# EAGLE design SparkFun_ZED-F9R_v11 (EAGLE 9.6.2)
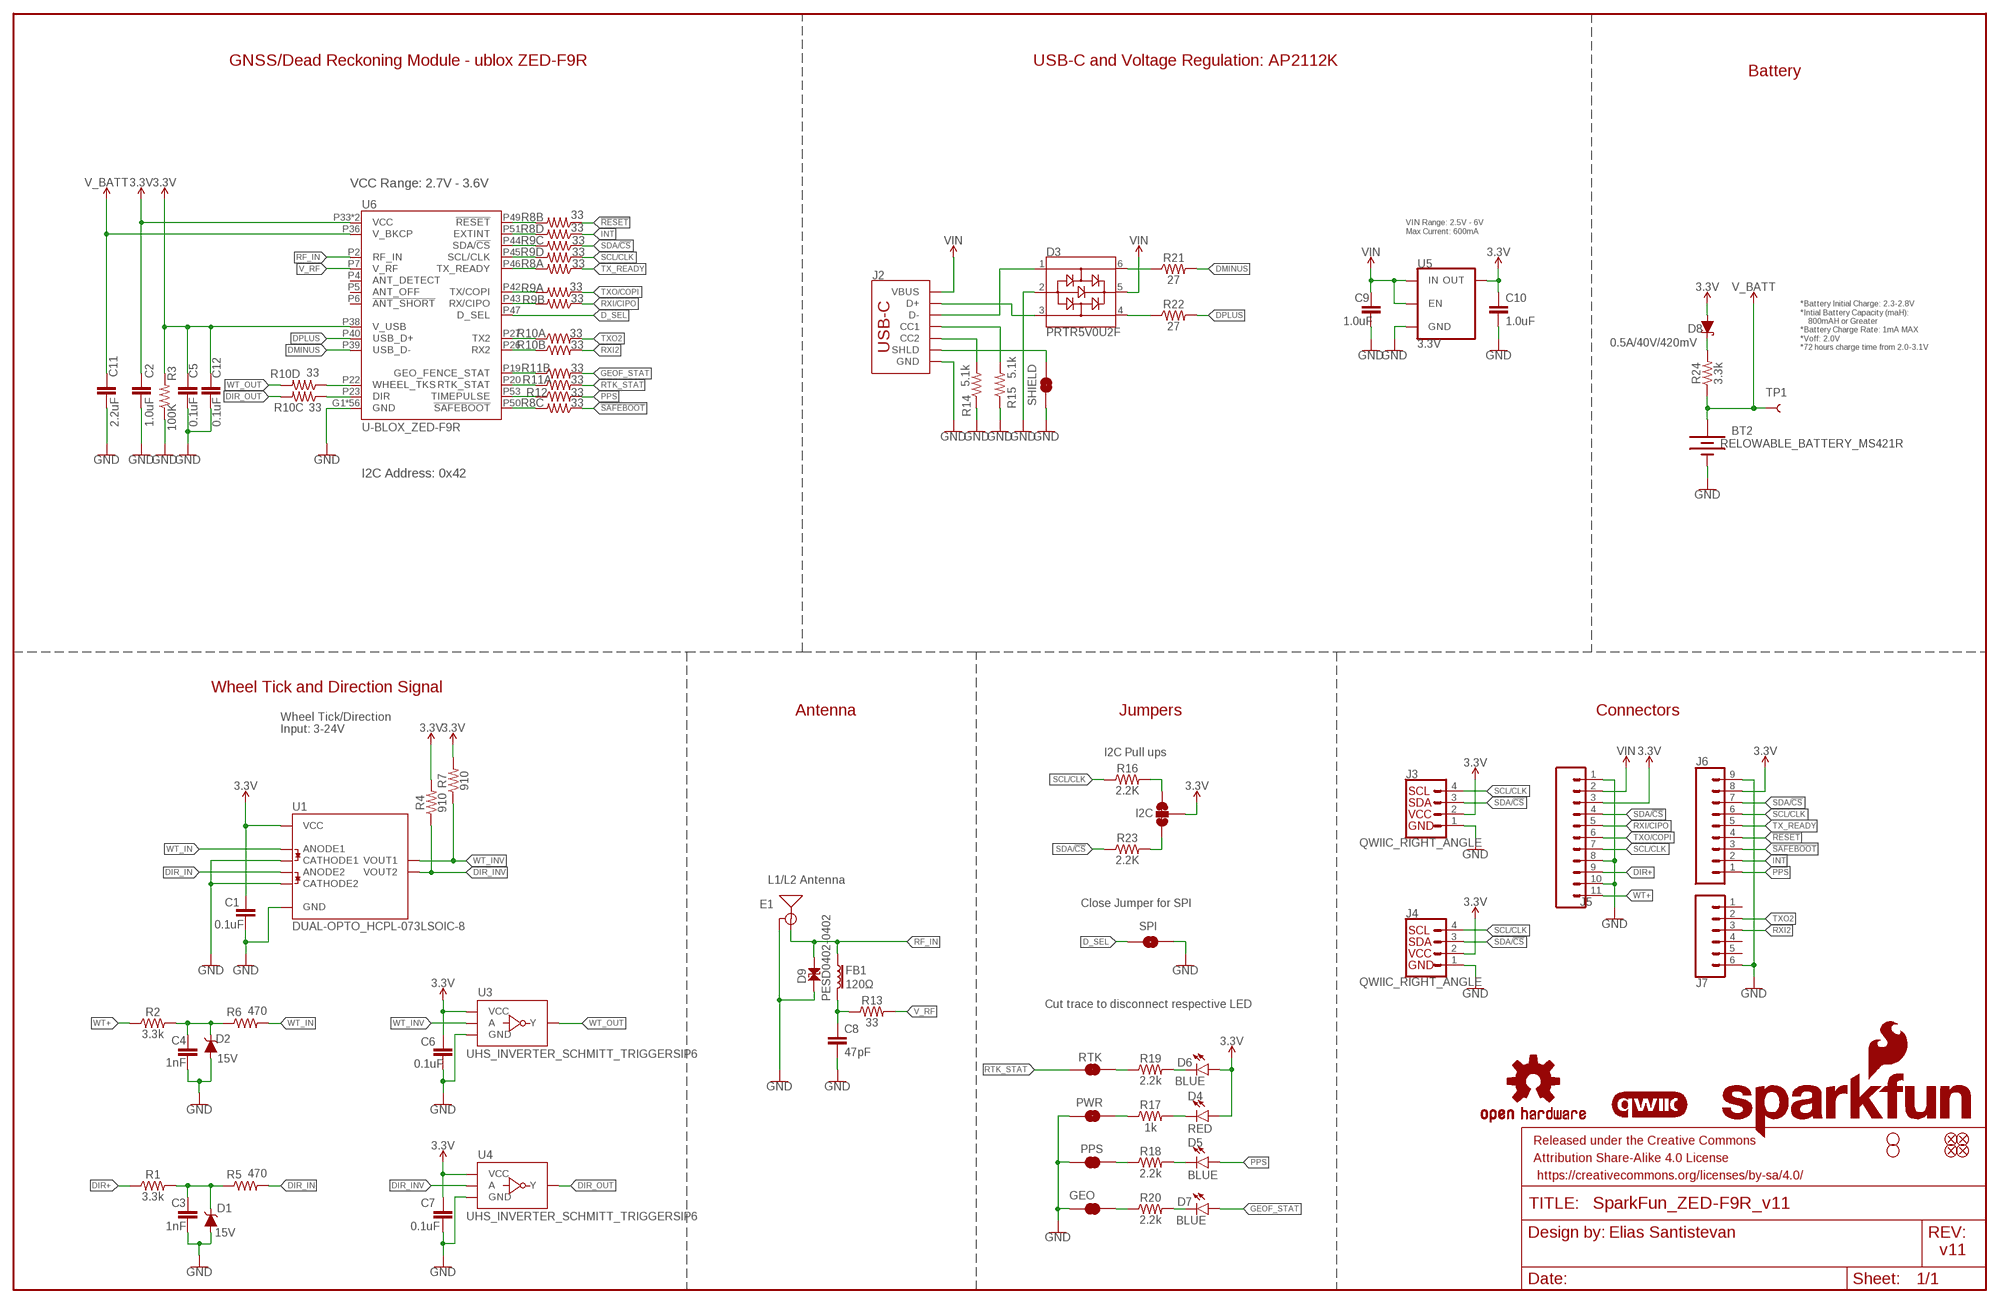
[diagram p0: schematic, sheet 1]

## Parts
$1_25_$_2020-03-30_22-52-05  STAND-OFFTIGHT  [STAND-OFF-TIGHT]
BT2  RELOWABLE_BATTERY_MS421R  [MS421R_IV03E]
C1  0.1uF  0.1UF-0402T-6.3V-10%-X7R  [0402-TIGHT]
C2  1.0uF  1.0UF-0402T-16V-10%  [0402-TIGHT]
C3  1nF  1.0NF/1000PF-0402-25V-10%-X7R  [0402]
C4  1nF  1.0NF/1000PF-0402-25V-10%-X7R  [0402]
C5  0.1uF  0.1UF-0402T-6.3V-10%-X7R  [0402-TIGHT]
C6  0.1uF  0.1UF-0402T-6.3V-10%-X7R  [0402-TIGHT]
C7  0.1uF  0.1UF-0402T-6.3V-10%-X7R  [0402-TIGHT]
C8  47pF  47PF-0402-25V-5%-X7R  [0402]
C9  1.0uF  1.0UF-0402T-16V-10%  [0402-TIGHT]
C10  1.0uF  1.0UF-0402T-16V-10%  [0402-TIGHT]
C11  2.2uF  2.2UF-0402_TIGHT-10V-10%-X5R  [0402-TIGHT]
C12  0.1uF  0.1UF-0402T-6.3V-10%-X7R  [0402-TIGHT]
D1  15V  DIODE-ZENER-BZX84C15LT3G  [SOT23-3]
D2  15V  DIODE-ZENER-BZX84C15LT3G  [SOT23-3]
D3  PRTR5V0U2F  [SOT886]
D4  RED  LED-RED0603  [LED-0603]
D5  BLUE  LED-BLUE0603  [LED-0603]
D6  BLUE  LED-BLUE0603  [LED-0603]
D7  BLUE  LED-BLUE0603  [LED-0603]
D8  0.5A/40V/420mV  DIODE-SCHOTTKY-PMEG4005EJ  [SOD-323]
D9  PESD0402-0402  [0402]
E1  ANTENNA-SMA-GROUNDEDEDGE_SMA  [SMA-EDGE]
FB1  120Ω  FERRITE_BEAD-120_OHM-0402  [0402]
FD1  FIDUCIALUFIDUCIAL  [FIDUCIAL-MICRO]
FD2  FIDUCIALUFIDUCIAL  [FIDUCIAL-MICRO]
FD3  FIDUCIALUFIDUCIAL  [FIDUCIAL-MICRO]
FD4  FIDUCIALUFIDUCIAL  [FIDUCIAL-MICRO]
FRAME1  FRAME-LEDGER  [CREATIVE_COMMONS]
GEO  JUMPER-SMT_2_NC_TRACE_SILK  [SMT-JUMPER_2_NC_TRACE_SILK]
H2  STAND-OFFTIGHT  [STAND-OFF-TIGHT]
I2C  JUMPER-SMT_3_2-NC_TRACE_SILK  [SMT-JUMPER_3_2-NC_TRACE_SILK]
J2  USB_C_2-LAYER_PADS  [USB-C-16P-2LAYER-PADS]
J3  QWIIC_RIGHT_ANGLE  QWIIC_CONNECTORJS-1MM  [JST04_1MM_RA]
J4  QWIIC_RIGHT_ANGLE  QWIIC_CONNECTORJS-1MM  [JST04_1MM_RA]
J5  CONN_111X11_NO_SILK  [1X11_NO_SILK]
J6  CONN_09NO_SILK  [1X09_NO_SILK]
J7  CONN_06NO_SILK_NO_POP  [1X06_NO_SILK]
LOGO1  OSHW-LOGOS  [OSHW-LOGO-S]
LOGO2  QWIIC_LOGO_4MM  [QWIIC_4MM]
LOGO3  SFE_LOGO_NAME_FLAME.2_INCH  [SFE_LOGO_NAME_FLAME_.2]
PPS  JUMPER-SMT_2_NC_TRACE_SILK  [SMT-JUMPER_2_NC_TRACE_SILK]
PWR  JUMPER-SMT_2_NC_TRACE_SILK  [SMT-JUMPER_2_NC_TRACE_SILK]
R1  3.3k  3.3KOHM-0603-1/10W-1%  [0603]
R2  3.3k  3.3KOHM-0603-1/10W-1%  [0603]
R3  100K  100KOHM-0402-1/16W-1%  [0402]
R4  910  910OHM-0603-1/10W-5%  [0603]
R5  470  470OHM-0603-1/10W-1%  [0603]
R6  470  470OHM-0603-1/10W-1%  [0603]
R7  910  910OHM-0603-1/10W-5%  [0603]
R8  33  33OHM_RA-1206-1/16W-5%  [1206_RA]
R9  33  33OHM_RA-1206-1/16W-5%  [1206_RA]
R10  33  33OHM_RA-1206-1/16W-5%  [1206_RA]
R11  33  33OHM_RA-1206-1/16W-5%  [1206_RA]
R12  33  33OHM-0603-1/10W-1%  [0603]
R13  33  33OHM-0603-1/10W-1%  [0603]
R14  5.1k  5.1KOHM-0402-1/16W-1%  [0402]
R15  5.1k  5.1KOHM-0402-1/16W-1%  [0402]
R16  2.2K  2.2KOHM-0402-1/16W-1%  [0402]
R17  1KOHM-0402-1/16W-1%  [0402]
R18  2.2k  2.2KOHM-0603-1/10W-1%  [0603]
R19  2.2k  2.2KOHM-0603-1/10W-1%  [0603]
R20  2.2k  2.2KOHM-0603-1/10W-1%  [0603]
R21  27  27OHM-0603-1/10W-1%  [0603]
R22  27  27OHM-0603-1/10W-1%  [0603]
R23  2.2K  2.2KOHM-0402-1/16W-1%  [0402]
R24  3.3k  3.3KOHM-0603-1/10W-1%  [0603]
RTK  JUMPER-SMT_2_NC_TRACE_SILK  [SMT-JUMPER_2_NC_TRACE_SILK]
SHIELD  JUMPER-SMT_2_NC_TRACE_SILK  [SMT-JUMPER_2_NC_TRACE_SILK]
SPI  JUMPER-SMT_2_NO_SILK  [SMT-JUMPER_2_NO_SILK]
TP1  TEST-POINT3X5  [PAD.03X.05]
U1  DUAL-OPTO_HCPL-073LSOIC-8  [SO08]
U3  UHS_INVERTER_SCHMITT_TRIGGERSIP6  UHS_INVERTER_SCHMITT_TRIGGER_MPAK2  [SIP6_MICROPAK2]
U4  UHS_INVERTER_SCHMITT_TRIGGERSIP6  UHS_INVERTER_SCHMITT_TRIGGER_MPAK2  [SIP6_MICROPAK2]
U5  3.3V  V_REG_AP2112K-3.3V  [SOT23-5]
U6  U-BLOX_ZED-F9R  [UBLOX_ZED_F9R]

## Nets
3.3V: C1.1 C2.1 C5.1 C6.1 C7.1 C10.1 C12.1 D4.A D6.A D8.A I2C.2 J3.2 J4.2 J5.3 J6.8 R3.2 R4.2 R7.2 U1.8(VCC) U3.P6(VCC) U4.P6(VCC) U5.5(OUT) U6.P33(VCC) U6.P34(VCC) U6.P38(V_USB)
!RESET: J6.4 R8.P2
!SAFEBOOT: J6.3 R8.P3
D_SEL: SPI.1 U6.P47(D_SEL)
DIR+: J5.9 R1.1
DIR_IN: R5.2 U1.4(ANODE2)
DIR_INV: R4.1 U1.6(VOUT2) U4.P2(A)
DIR_OUT: R10.P6 U4.P4(Y)
DMINUS: R21.2 U6.P39(USB_D-)
DPLUS: R22.2 U6.P40(USB_D+)
GEOF_STAT: D7.A R11.P7
GND: BT2.- C1.2 C2.2 C3.2 C4.2 C5.2 C6.2 C7.2 C8.2 C9.2 C10.2 C11.2 C12.2 D1.1(A) D2.1(A) D3.2 D9.1 E1.GND@0(GND) E1.GND@1(GND) E1.GND@2(GND) E1.GND@3(GND) GEO.1 J2.GND J2.GND2(GND) J3.1 J4.1 J5.1 J5.8 J5.10 J6.9 J7.6 PPS.1 PWR.1 R3.1 R14.1 R15.1 SHIELD.1 SPI.2 U1.2(CATHODE1) U1.3(CATHODE2) U1.5(GND) U3.P3(GND) U4.P3(GND) U5.2(GND) U6.G1(GND) U6.G2(GND) U6.G3(GND) U6.G4(GND) U6.G5(GND) U6.G6(GND) U6.G7(GND) U6.G8(GND) U6.G9(GND) U6.G10(GND) U6.G11(GND) U6.G12(GND) U6.G13(GND) U6.G14(GND) U6.G15(GND) U6.G16(GND) U6.G17(GND) U6.G18(GND) U6.G19(GND) U6.G20(GND) U6.G21(GND) U6.G22(GND) U6.G23(GND) U6.G24(GND) U6.G25(GND) U6.G26(GND) U6.G27(GND) U6.G28(GND) U6.G29(GND) U6.G30(GND) U6.G31(GND) U6.G32(GND) U6.G33(GND) U6.G34(GND) U6.G35(GND) U6.G36(GND) U6.G37(GND) U6.G38(GND) U6.G39(GND) U6.G40(GND) U6.G41(GND) U6.G42(GND) U6.G43(GND) U6.G44(GND) U6.G45(GND) U6.G46(GND) U6.G47(GND) U6.G48(GND) U6.P1(GND) U6.P3(GND) U6.P12(GND) U6.P14(GND) U6.P32(GND) U6.P37(GND) U6.P41(GND) U6.P48(GND)
INT: J6.2 R8.P4
N$1: I2C.1 R23.2
N$2: D8.C R24.2
N$3: I2C.3 R16.2
N$4: D4.C R17.2
N$5: C8.1 FB1.2 R13.1
N$6: D3.3 J2.A6(D+) J2.B6(D+)
N$7: D3.1 J2.A7(D-) J2.B7(D-)
N$8: PWR.2 R17.1
N$9: D3.6 R21.1
N$10: D3.4 R22.1
N$11: R8.P7 U6.P49(!RESET!)
N$12: R8.P5 U6.P51(EXTINT)
N$14: J2.B5(CC2) R14.2
N$15: J2.A5(CC1) R15.2
N$16: R9.P6 U6.P44(SDA/!CS!)
N$17: R9.P5 U6.P45(SCL/CLK)
N$18: R8.P8 U6.P46(TX_READY)
N$19: R9.P8 U6.P42(TX/COPI)
N$20: R9.P7 U6.P43(RX/CIPO)
N$21: R10.P1 U6.P27(TX2)
N$22: R19.1 RTK.2
N$23: PPS.2 R18.1
N$24: D5.C R18.2
N$25: D6.C R19.2
N$26: R10.P2 U6.P26(RX2)
N$27: R11.P2 U6.P19(GEO_FENCE_STAT)
N$28: R11.P1 U6.P20(RTK_STAT)
N$29: R12.1 U6.P53(TIMEPULSE)
N$30: R8.P6 U6.P50(!SAFEBOOT!)
N$31: R10.P4 U6.P22(WHEEL_TKS)
N$32: R10.P3 U6.P23(DIR)
N$33: GEO.2 R20.1
N$34: D7.C R20.2
N$35: C4.1 D2.3(C) R2.2 R6.1
N$37: C3.1 D1.3(C) R1.2 R5.1
PPS: D5.A J6.1 R12.2
RF_IN [Antenna]: D9.2 E1.SIG(SIGNAL) FB1.1 U6.P2(RF_IN)
RTK_STAT: R11.P8 RTK.1
RXI2: J7.3 R10.P7
RXI/CIPO: J5.5 R9.P2
SCL/CLK: J3.4 J4.4 J5.7 J6.6 R9.P4 R16.1
SDA/!CS: J3.3 J4.3 J5.4 J6.7 R9.P3 R23.1
SHIELD: J2.SHLD1(SHLD) J2.SHLD2(SHLD) J2.SHLD3(SHLD) J2.SHLD4(SHLD) SHIELD.2
TX_READY: J6.5 R8.P1
TXO2: J7.2 R10.P8
TXO/COPI: J5.6 R9.P1
V_BATT: BT2.+ C11.1 R24.1 TP1.1 U6.P36(V_BKCP)
V_RF: R13.2 U6.P7(V_RF)
VIN: C9.1 D3.5 J2.VBUS1(VBUS) J2.VBUS2(VBUS) J5.2 U5.1(IN) U5.3(EN)
WT+: J5.11 R2.1
WT_IN: R6.2 U1.1(ANODE1)
WT_INV: R7.1 U1.7(VOUT1) U3.P2(A)
WT_OUT: R10.P5 U3.P4(Y)
Unconnected: J7.1 J7.4 J7.5 R11.P3 R11.P4 R11.P5 R11.P6 U6.P4(ANT_DETECT) U6.P5(ANT_OFF) U6.P6(!ANT_SHORT!)

## Notes on the sheet
- GNSS/Dead Reckoning Module - ublox ZED-F9R | USB-C and Voltage Regulation: AP2112K
- Battery
- VCC Range: 2.7V - 3.6V
- VIN Range: 2.5V - 6V
  Max Current: 600mA
- *Battery Initial Charge: 2.3-2.8V
  *Intial Battery Capacity (maH): 
      800mAH or Greater
  *Battery Charge Rate: 1mA MAX
  *Voff: 2.0V
  *72 hours charge time from 2.0-3.1V
- I2C Address: 0x42
- Wheel Tick and Direction Signal
- Antenna | Jumpers | Connectors
- Wheel Tick/Direction
  Input: 3-24V
- I2C Pull ups
- L1/L2 Antenna
- Close Jumper for SPI
- Cut trace to disconnect respective LED
- 1k
- Elias Santistevan
- v11

## Library data of the parts
$1_25_$_2020-03-30_22-52-05 H2 = SparkFun-Hardware:STAND-OFF: Stand Off Drill holes for mechanically mounting via screws, standoffs, etc. Note: Use the keepout ring to avoid running the screw head into surrounding components. Variant Overviews STAND-OFF - Mechanical footprint for a #4 phillips button head screw. STAND-OFF-TIGHT - Mechanical footprint for a #4 phillips button head screw, Example SparkFun Products Screw - Phillips Head (1/4", 4-40, 10 pack) <https://www.sparkfun.com/products/10453> (PRT-10453) Screw - Phillips Head (1/2", 4-40, 10 pack) <https://www.sparkfun.com/products/10452> (PRT-10452) Screw - Phillips Head (3/4", 4-40, 10 pack) <https://www.sparkfun.com/products/10451> (PRT-10451) Screw - Phillips Head (1", 4-40, 10 pack) <https://www.sparkfun.com/products/10450> (PRT-10450)
BT2 = SparkFun-Batteries:RELOWABLE_BATTERY: SEIKO Reflowable Lithium Batteries; PROD_ID: BAT-16685
C1 C5-C7 C12 = SparkFun-Capacitors:0.1UF: 0.1µF ceramic capacitors A capacitor is a passive two-terminal electrical component used to store electrical energy temporarily in an electric field.; PROD_ID: CAP-14993
C2 C9 C10 = SparkFun-Capacitors:1.0UF: 1µF ceramic capacitors A capacitor is a passive two-terminal electrical component used to store electrical energy temporarily in an electric field.; PROD_ID: CAP-12417
C3 C4 = SparkFun-Capacitors:1.0NF/1000PF: 1nF/1,000pF ceramic capacitors A capacitor is a passive two-terminal electrical component used to store electrical energy temporarily in an electric field.; PROD_ID: CAP-15061
C8 = SparkFun-Capacitors:47PF: 47pF ceramic capacitors A capacitor is a passive two-terminal electrical component used to store electrical energy temporarily in an electric field.; PROD_ID: CAP-15063
C11 = SparkFun-Capacitors:2.2UF: 2.2µF ceramic capacitors A capacitor is a passive two-terminal electrical component used to store electrical energy temporarily in an electric field.; PROD_ID: CAP-14232
D1 D2 = SparkFun-DiscreteSemi:DIODE-ZENER: Zener Diode A Zener diode allows current to flow from its anode to its cathode like a normal semiconductor diode, but it also permits current to flow in the reverse direction when its "Zener voltage" is reached. - WIkipedia; PROD_ID: DIO-15071
D3 = SparkFun-IC-Power:PRTR5V0U2: A small ESD protection device. Most commonly used on USB D+/D- signals to protect large, expensive, or especially sensitive USB enabled devices.; PROD_ID: DIO-14084
D4 = SparkFun-LED:LED-RED: Red SMD LED Used in manufacturing of most products at SparkFun Packages: 0603 - SMD 0603 package [Product Link] <http://docs.avagotech.com/docs/AV02-0551EN> 0603 SMART - SMD 0603 SMART package ( more efficient and expensive)[Product Link] <http://www.osram-os.com/Graphics/XPic2/00077099_0.pdf> 1206 - SMD1206 package [Product Link] <https://www.sparkfun.com/datasheets/DevTools/LilyPad/Q150OVS4.pdff> SparkFun Products: Pro Mini 328 -5V <https://www.sparkfun.com/products/821> RedBoard <https://www.sparkfun.com/products/12757> IOIO-OTG <https://www.sparkfun.com/products/13613>; PROD_ID: DIO-00819
D5-D7 = SparkFun-LED:LED-BLUE: Blue SMD LED Used in manufacturing of various products at SparkFun Packages: 0603 - SMD 0603 package [Product Link] <http://www.digikey.com/product-detail/en/SMLE12BC7TT86/511-1589-2-ND/1641808> 1206 - SMD1206 package [Product Link] <http://www.digikey.com/product-detail/en/lite-on-inc/LTST-C150TBKT/160-1643-1-ND/573584> SparkFun Products: ESP8266 Thing-Dev Board <https://www.sparkfun.com/products/13711> RedBoard <https://www.sparkfun.com/products/12757>; PROD_ID: DIO-08575
D8 = SparkFun-DiscreteSemi:DIODE-SCHOTTKY: Schottky diode A Schottky diode is a semiconductor diode which has a low forward voltage drop and a very fast switching action.; PROD_ID: DIO-10955
D9 = SparkFun-DiscreteSemi:PESD0402: ESD protection diode PESD is used to protect a signal line from ESD.; DIGIKEY_PART: PESD0402-140CT-ND; MOUSE_PART: 650-PESD0402-140; PROD_ID: DIO-15359
E1 = SparkFun-RF:ANTENNA-SMA-GROUNDED: SMA Antenna Connector w/ Ground Edge-mount and SMD SMA connectors for RF Antennas. **4-LAYER BOARD WARNING!!** When designing a 4-layer board using any of the SMD variants, you will need to manually add a cutout polygon on any internal power layers to make sure that you don't end up with exposed copper around the edge of the routed hole for these connectors. Exposed power copper could then short to the connector body - and that would be bad. Why hasn't anyone added the cutout polygons directly to the connector footprint? Well, your internal layers (usually 2 and 15) may be covered with GND polygons and you might well want the copper to go all the way to the edge, especially under the connector SIGNAL pin. So adding cutouts to the footprint might make matters worse, not better...; PROD_ID: CONN-08289
FB1 = SparkFun-Coils:FERRITE_BEAD-120_OHM: Ferrite Bead (blocks, cores, rings, chokes, etc.) Inductor with layers of ferrite used to suppress high frequencies. Often used to isolate high frequency noise.; MFG_PART: BLM15HB121SN1D; PROD_ID: NDUC-14206
FD1-FD4 = SparkFun-Aesthetics:FIDUCIAL: Fiducial Alignment Points Point-of-reference for pick-and-place machines and other optical instruments.
FRAME1 = SparkFun-Aesthetics:FRAME-LEDGER: Schematic Frame - Ledger Standard 11x14 US Ledger frame
GEO PPS PWR RTK SHIELD = SparkFun-Jumpers:JUMPER-SMT_2_NC_TRACE: Normally closed trace jumper This jumper has a trace between two pads so it's normally closed (NC). Use a razor knife to open the connection. For best results follow the IPC guidelines for cutting traces: Cutout at least 0.063 mm (0.005 in). Remove all loose material to clean up the cut area. Seal the cut with an approved epoxy. Reapply solder to reclose the connection.
I2C = SparkFun-Jumpers:JUMPER-SMT_3_2-NC_TRACE: Normally closed trace jumper (2 of 2 connections) This jumper has a trace between all three pads so they are normally closed (NC). Use a razor knife to open the connection(s). For best results follow the IPC guidelines for cutting traces: Cutout at least 0.063 mm (0.005 in). Remove all loose material to clean up the cut area. Seal the cut with an approved epoxy. Reapply solder to reclose the connection(s).
J2 = SparkFun-Connectors:USB_C: USB Type C 16Pin Connector Super Speed pins not available on the 16-pin purely SMD connector so this part is best for USB 2.0 implementations. D1 and D2 are tied together enabling D+/- no matter which way the cable is plugged into the connector. The two channel configuration pins (CC1/2) are exposed. These are normally connected to ground via 5.1k resistors but can be reconfigured for high current/high power applications. **4-LAYER BOARD WARNING!!** If designing 4-layer board, make sure to select the variant _4-LAYER-ISOLATED. The linked footprint (USB-C-16-4LAYER-ISOLATED) includes some very necessary cutout polygons in the inner layers (2 and 15). This prevents the PTH mounting shield legs on the USB connector from electrically connecting any other polygons on the inner layers (usually VCC and GND).; PROD_ID: CONN-14122
J3 J4 = SparkFun-Connectors:QWIIC_CONNECTOR: SparkFun I2C Standard Qwiic Connector An SMD 1mm pitch JST connector makes it easy and quick (get it? Qwiic?) to connect I2C devices to each other. The Qwiic system <http://www.sparkfun.com/qwiic> enables fast and solderless connection between popular platforms and various sensors and actuators. We carry 200mm <https://www.sparkfun.com/products/14204>, 100mm <https://www.sparkfun.com/products/14205>, 50mm <https://www.sparkfun.com/products/14206>, and breadboard friendly <https://www.sparkfun.com/products/14207> Qwiic cables. We also offer 10 pcs strips <https://www.sparkfun.com/products/14323> the SMD connectors.; PROD_ID: CONN-13694
J5 = SparkFun-Connectors:CONN_11: Multi connection point. Often used as Generic Header-pin footprint for 0.1 inch spaced/style header connections On any of the 0.1 inch spaced packages, you can populate with these: Break Away Headers - Straight <https://www.sparkfun.com/products/116> (PRT-00116) Break Away Male Headers - Right Angle <https://www.sparkfun.com/products/553> (PRT-00553) Female Headers <https://www.sparkfun.com/products/115> (PRT-00115) Break Away Headers - Machine Pin <https://www.sparkfun.com/products/117> (PRT-00117) Break Away Female Headers - Swiss Machine Pin <https://www.sparkfun.com/products/743> (PRT-00743) For SCREWTERMINALS and SPRING TERMINALS visit here: Screw Terimnals on SparkFun.com <https://www.sparkfun.com/search/results?term=Screw+Terminals> (5mm/3.5mm/2.54mm spacing) This device is also useful as a general connection point to wire up your design to another part of your project. Our various solder wires solder well into these plated through hole pads. Hook-Up Wire - Assortment (Stranded, 22 AWG) <https://www.sparkfun.com/products/11375> (PRT-11375) Hook-Up Wire - Assortment (Solid Core, 22 AWG) <https://www.sparkfun.com/products/11367> (PRT-11367) View the entire wire category on our website here <https://www.sparkfun.com/categories/141>
J6 = SparkFun-Connectors:CONN_09: Multi connection point. Often used as Generic Header-pin footprint for 0.1 inch spaced/style header connections On any of the 0.1 inch spaced packages, you can populate with these: Break Away Headers - Straight <https://www.sparkfun.com/products/116> (PRT-00116) Break Away Male Headers - Right Angle <https://www.sparkfun.com/products/553> (PRT-00553) Female Headers <https://www.sparkfun.com/products/115> (PRT-00115) Break Away Headers - Machine Pin <https://www.sparkfun.com/products/117> (PRT-00117) Break Away Female Headers - Swiss Machine Pin <https://www.sparkfun.com/products/743> (PRT-00743) For SCREWTERMINALS and SPRING TERMINALS visit here: Screw Terimnals on SparkFun.com <https://www.sparkfun.com/search/results?term=Screw+Terminals> (5mm/3.5mm/2.54mm spacing) This device is also useful as a general connection point to wire up your design to another part of your project. Our various solder wires solder well into these plated through hole pads. Hook-Up Wire - Assortment (Stranded, 22 AWG) <https://www.sparkfun.com/products/11375> (PRT-11375) Hook-Up Wire - Assortment (Solid Core, 22 AWG) <https://www.sparkfun.com/products/11367> (PRT-11367) View the entire wire category on our website here <https://www.sparkfun.com/categories/141> Special notes: Molex polarized connector foot print use with SKU : PRT-08231 with associated crimp pins and housings. 1MM SMD Version SKU: PRT-10208 NOTES ON THE VARIANTS LOCK and LOCK_LONGPADS... This footprint was designed to help hold the alignment of a through-hole component (i.e. 6-pin header) while soldering it into place. You may notice that each hole has been shifted either up or down by 0.005 of an inch from it's more standard position (which is a perfectly straight line). This slight alteration caused the pins (the squares in the middle) to touch the edges of the holes. Because they are alternating, it causes a "brace" to hold the component in place. 0.005 has proven to be the perfect amount of "off-center" position when using our standard breakaway headers. Although looks a little odd when you look at the bare footprint, once you have a header in there, the alteration is very hard to notice. Also,if you push a header all the way into place, it is covered up entirely on the bottom side.
J7 = SparkFun-Connectors:CONN_06: Multi connection point. Often used as Generic Header-pin footprint for 0.1 inch spaced/style header connections On any of the 0.1 inch spaced packages, you can populate with these: Break Away Headers - Straight <https://www.sparkfun.com/products/116> (PRT-00116) Break Away Male Headers - Right Angle <https://www.sparkfun.com/products/553> (PRT-00553) Female Headers <https://www.sparkfun.com/products/115> (PRT-00115) Break Away Headers - Machine Pin <https://www.sparkfun.com/products/117> (PRT-00117) Break Away Female Headers - Swiss Machine Pin <https://www.sparkfun.com/products/743> (PRT-00743) Arduino Stackable Header - 6 Pin <https://www.sparkfun.com/products/9280> (PRT-09280) Screw Terminals 2.54mm Pitch (6-Pin) <https://www.sparkfun.com/products/16499> (PRT-16499) For SCREWTERMINALS and SPRING TERMINALS visit here: Screw Terimnals on SparkFun.com <https://www.sparkfun.com/search/results?term=Screw+Terminals> (5mm/3.5mm/2.54mm spacing) This device is also useful as a general connection point to wire up your design to another part of your project. Our various solder wires solder well into these plated through hole pads. Hook-Up Wire - Assortment (Stranded, 22 AWG) <https://www.sparkfun.com/products/11375> (PRT-11375) Hook-Up Wire - Assortment (Solid Core, 22 AWG) <https://www.sparkfun.com/products/11367> (PRT-11367) View the entire wire category on our website here <https://www.sparkfun.com/categories/141>
LOGO1 = SparkFun-Aesthetics:OSHW-LOGO: Open-Source Hardware (OSHW) Logo This logo indicates the piece of hardware it is found on incorporates a OSHW license and/or adheres to the definition of open source hardware found here: http://freedomdefined.org/OSHW
LOGO2 = SparkFun-Aesthetics:QWIIC_LOGO: Qwiic Logos for placement on schematic and PCB. The 5.5mm silk logo is best for placing next to Qwiic connector.
LOGO3 = SparkFun-Aesthetics:SFE_LOGO_NAME_FLAME: SparkFun Font Logo w/ Flame This is the SparkFun full logo. The logo on the schematic will always be the same size; the package variant is the height of the flame part of the logo. Default layer for the logo on the board is tSilk.
R1 R2 R24 = SparkFun-Resistors:3.3KOHM: 3.3kΩ resistor A resistor is a passive two-terminal electrical component that implements electrical resistance as a circuit element. Resistors act to reduce current flow, and, at the same time, act to lower voltage levels within circuits. - Wikipedia; PROD_ID: RES-07851
R3 = SparkFun-Resistors:100KOHM: 100kΩ resistor A resistor is a passive two-terminal electrical component that implements electrical resistance as a circuit element. Resistors act to reduce current flow, and, at the same time, act to lower voltage levels within circuits. - Wikipedia; PROD_ID: RES-13495
R4 R7 = SparkFun-Resistors:910OHM: 910 Ohm Resistor A resistor is a passive two-terminal electrical component that implements electrical resistance as a circuit element. Resistors act to reduce current flow, and, at the same time, act to lower voltage levels within circuits. - Wikipedia Digikey Link <https://www.digikey.com/product-detail/en/yageo/RC0603JR-07910RL/311-910GRTR-ND/726838>; PROD_ID: RES-13860
R5 R6 = SparkFun-Resistors:470OHM: 470Ω resistor A resistor is a passive two-terminal electrical component that implements electrical resistance as a circuit element. Resistors act to reduce current flow, and, at the same time, act to lower voltage levels within circuits. - Wikipedia; PROD_ID: RES-07869
R8-R11 = SparkFun-Resistors:33OHM_RA: EXB-38V330JV Four Resistory Array - AEC-Q200 Certified; PROD_ID: RES-15081
R12 R13 = SparkFun-Resistors:33OHM: 33Ω resistor A resistor is a passive two-terminal electrical component that implements electrical resistance as a circuit element. Resistors act to reduce current flow, and, at the same time, act to lower voltage levels within circuits. - Wikipedia; PROD_ID: RES-08270
R14 R15 = SparkFun-Resistors:5.1KOHM; PROD_ID: RES-14340
R16 R23 = SparkFun-Resistors:2.2KOHM: 2.2kΩ resistor A resistor is a passive two-terminal electrical component that implements electrical resistance as a circuit element. Resistors act to reduce current flow, and, at the same time, act to lower voltage levels within circuits. - Wikipedia; PROD_ID: RES-14341
R17 = SparkFun-Resistors:1KOHM: 1kΩ resistor A resistor is a passive two-terminal electrical component that implements electrical resistance as a circuit element. Resistors act to reduce current flow, and, at the same time, act to lower voltage levels within circuits. - Wikipedia; PROD_ID: RES-14342
R18-R20 = SparkFun-Resistors:2.2KOHM: 2.2kΩ resistor A resistor is a passive two-terminal electrical component that implements electrical resistance as a circuit element. Resistors act to reduce current flow, and, at the same time, act to lower voltage levels within circuits. - Wikipedia; PROD_ID: RES-08272
R21 R22 = SparkFun-Resistors:27OHM: 27Ω resistor A resistor is a passive two-terminal electrical component that implements electrical resistance as a circuit element. Resistors act to reduce current flow, and, at the same time, act to lower voltage levels within circuits. - Wikipedia; PROD_ID: RES-09334
SPI = SparkFun-Jumpers:JUMPER-SMT_2_NO: Normally open jumper This jumper has two pads in close proximity to each other. Apply solder to close the connection. Round pads are easier to solder for beginners, but are a lot larger. SparkFun Product that uses the round pads: SparkFun EL Sequencer <https://www.sparkfun.com/products/12781>
TP1 = SparkFun-Connectors:TEST-POINT: SparkFun Test Points Bare copper test points for troubleshooting or In-Circuit-Testing. These are used by our Production team for verifying production board runs using pogo-pins on test beds. SparkFun Products: SparkFun LSM9DS1 Breakout <https://www.sparkfun.com/products/13284> SparkFun PSOC <https://www.sparkfun.com/products/13714> SparkFun Load Cell Amplifier <https://www.sparkfun.com/products/13879>
U1 = SparkFun-DiscreteSemi:DUAL-OPTO_HCPL-073L: HCPL-073L These high gain series couplers use a Light Emitting Diode and an integrated high gain photodetector to provide extremely high current transfer ratio between input and output. Separate pins for the photodiode and output stage result in LVTTL compatible saturation voltages and high speed operation. Where desired, the VCC and VO terminals may be tied together to achieve conventional photo-darlington operation. A base access terminal allows a gain bandwidth adjustment to be made. These optocouplers are for use in LVTTL/LVCMOS or other low power applications. A 400% minimum current transfer ratio is guaranteed over 0 to +70˚C operating range for only 0.5 mA of LED current. Digikey Link <https://www.digikey.com/product-detail/en/broadcom-limited/HCPL-073L-500E/516-4204-2-ND/1234512>; PROD_ID: IC-15070
U3 U4 = SparkFun-IC-Amplifiers:UHS_INVERTER_SCHMITT_TRIGGER: NC7SZ14 The NC7SZ14 is a single inverter with Schmitt trigger input from ON Semiconductor’s Ultra−High Speed (UHS) series of TinyLogic. The device is fabricated with advanced CMOS technology to achieve ultra−high speed with high output drive while maintaining low static power dissipation over a very broad VCC operating range. The device is specified to operate over the 1.65 V to 5.5 V VCC range. The inputs and outputs are high−impedance when VCC is 0 V. Inputs tolerate voltages up to 5.5 V independent of VCC operating voltage. Digikey Link <https://www.digikey.com/product-detail/en/on-semiconductor/NC7SZ14M5X/NC7SZ14M5XDKR-ND/1628606>; PROD_ID: IC-17000
U5 = SparkFun-IC-Power:V_REG_AP2112: AP2112 - 600mA CMOS LDO Regulator w/ Enable The AP2112 is CMOS process low dropout linear regulator with enable function, the regulator delivers a guaranteed 600mA (min.) continuous load current. Features Output Voltage Accuracy: ±1.5% Output Current: 600mA (Min.) Foldback Short Current Protection: 50mA Enable Function to Turn ON/OFF VOUT Low Dropout Voltage (3.3V): 250mV (Typ.) @IOUT=600mA Excellent Load Regulation: 0.2%/A (Typ.) Excellent Line Regulation: 0.02%/V (Typ.) Low Quiescent Current: 55μA (Typ.) Low Standby Current: 0.01μA (Typ.) Low Output Noise: 50μVRMS PSRR: 100Hz -65dB, 1kHz -65dB OTSD Protection Stable with 1.0μF Flexible Cap: Ceramic, Tantalum and Aluminum Electrolytic Operation Temperature Range: -40°C to 85°C ESD: MM 400V, HBM 4000V; PROD_ID: VREG-12457
U6 = SparkFun-GPS:U-BLOX_ZED-F9R: u-blox ZED-F9K ADR GPS Unit with Real Time Kinematics (RTK) and internal IMU = Automotive Dead Reckoning; PROD_ID: IC-14716

## Net classes
1 Antenna: width 1 mm, clearance 0.3 mm
4 3.3V: width 0.2 mm, clearance 0.2 mm
9 PPS_DIFF: width 0.2 mm, clearance 0.11 mm to class 0, clearance 0.2 mm
10 DIGITAL: width 0.09 mm, clearance 0.1 mm

## Board
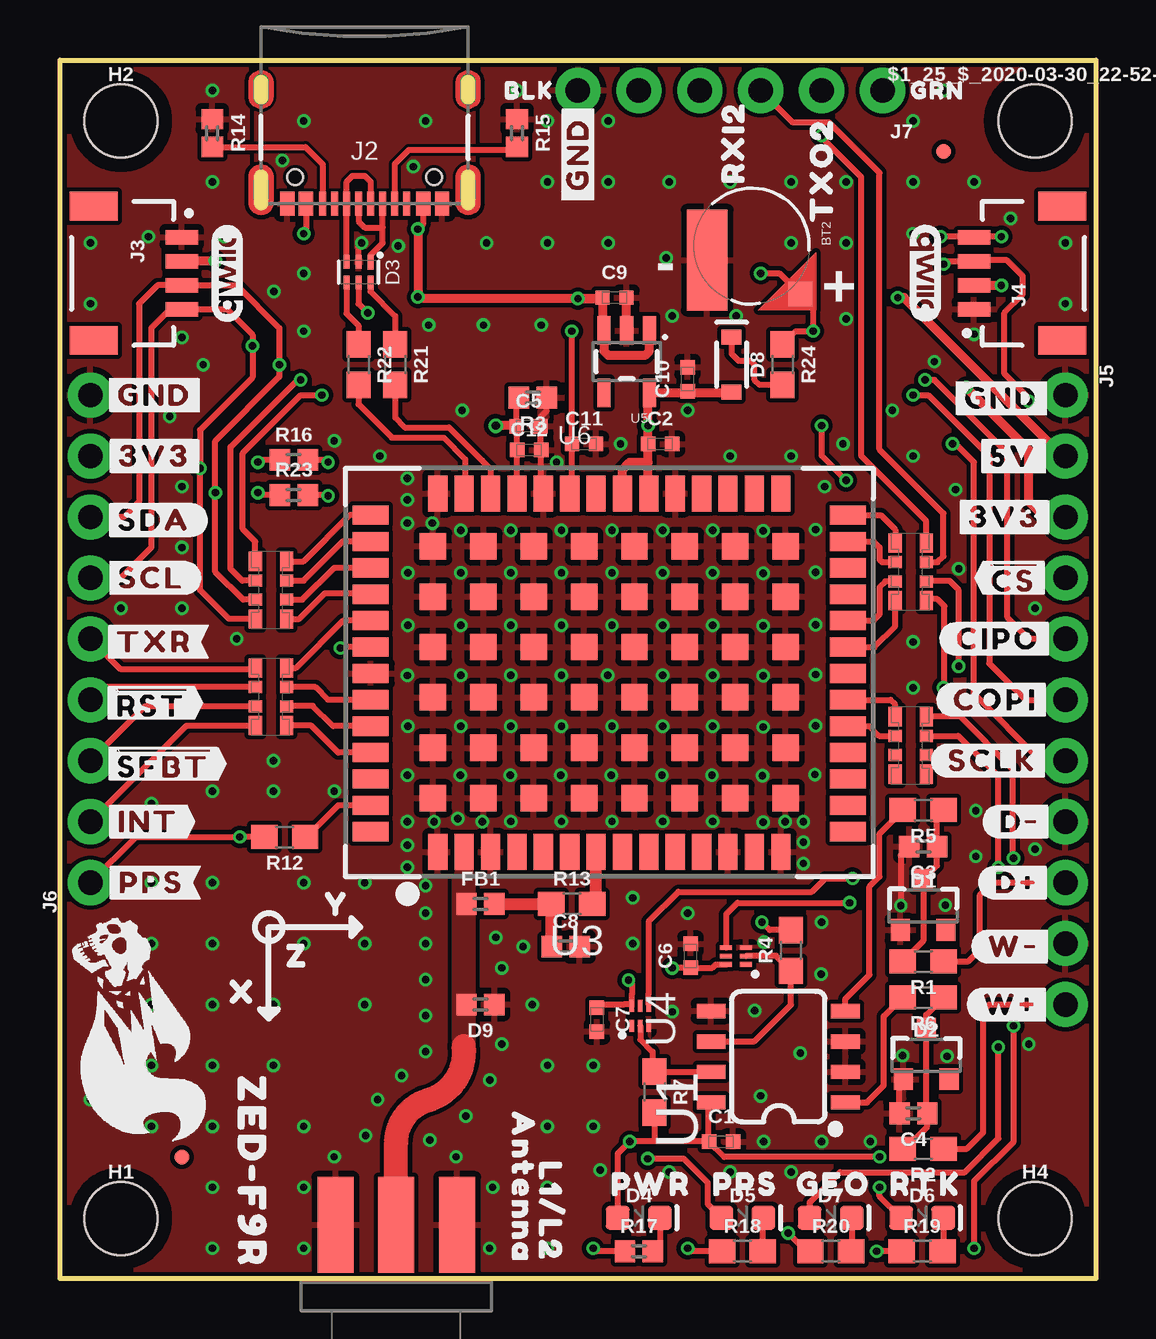
[diagram p1: board, top side]
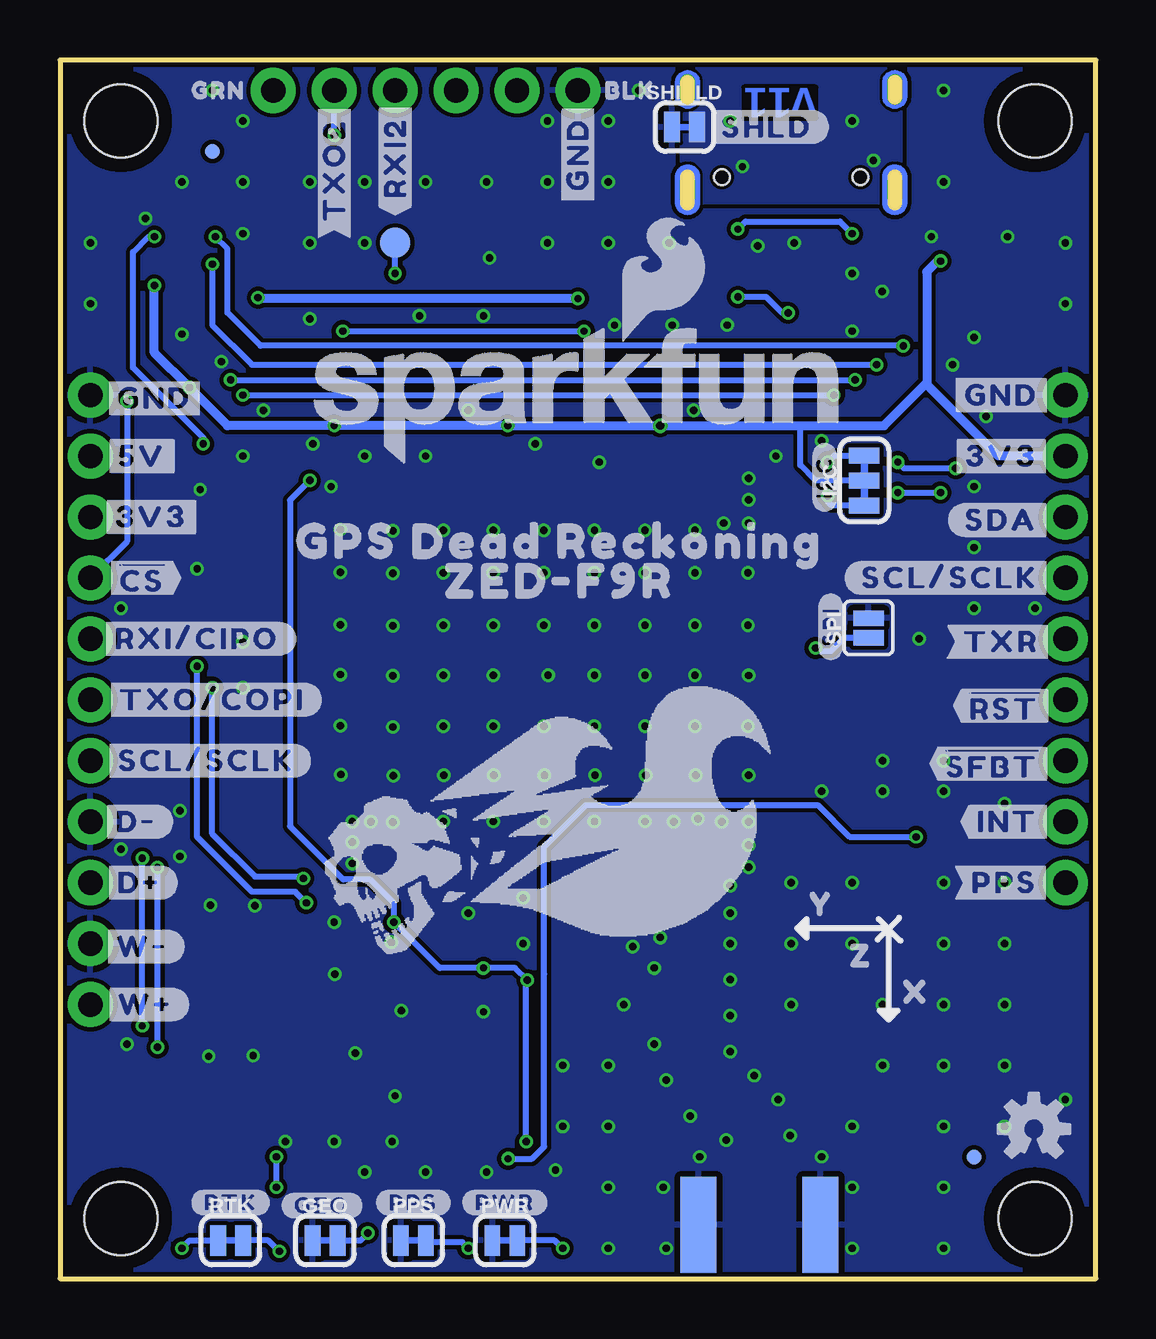
[diagram p2: board, bottom side, seen from below]

Size 43.18 x 50.8 mm. Coordinates in mm from the lower left corner, seen from the top.
Outline: 0,0 0,50.8 43.18,50.8 43.18,0 0,0
Copper layers (1*16): Top 0.035mm / dielectric 1.5mm / Bottom 0.035mm
Design rules "SparkFun-2-Layer-Minimum-JLCPCB": minimum track width 5mil, minimum drill 0.3mm, track to track 5mil, track to pad 5mil, pad to pad 5mil, via to via 5mil, smd to smd 5mil, copper to edge 7mil, drill to drill 7mil, minimum pad ring 5mil, minimum via ring 5mil, stop-mask expansion 2.5mil, vias tented up to drill 25mil, thermal gap 10mil

### Footprints (pad centres in the part's own frame; a part is rotated, then mirrored left to right if it is on the bottom)
STAND-OFF-TIGHT = hole 3.048: 0,0
MS421R_IV03E = smd 1 x 1: + 2.022,2.032 | smd 4.2 x 1.7: - 0.6,-1.85
0402-TIGHT = smd 0.6 x 0.6: 1 -0.5,0; 2 0.5,0
0402 = smd 0.85 x 0.9: 1 -0.58,0; 2 0.58,0
SOT23-3 = smd 0.8 x 0.9: 1 -0.95,-1; 2 0.95,-1; 3 0,1.1
SOT886 = smd 0.61 x 0.25: 1 -0.405,0.5 | smd 0.56 x 0.25: 2 -0.43,0; 3 -0.43,-0.5; 4 0.43,-0.5; 5 0.43,0; 6 0.43,0.5
LED-0603 = smd 1 x 1: A -0.877,0; C 0.877,0
SOD-323 = smd 0.63 x 0.83: A 1.15,0; C -1.15,0
SMA-EDGE = smd 1.5 x 4: GND@0 -2.54,0; GND@1 2.54,0; SIG 0,0 | smd 1.5 x 4 bottom: GND@2 -2.54,0; GND@3 2.54,0
FIDUCIAL-MICRO = smd 0.635 x 0.635: 1 0,0
SMT-JUMPER_2_NC_TRACE_SILK = smd 0.66 x 1.27: 1 -0.521,0; 2 0.521,0
SMT-JUMPER_3_2-NC_TRACE_SILK = smd 0.66 x 1.27: 1 -1.041,0; 2 0,0; 3 1.041,0
USB-C-16P-2LAYER-PADS = smd 0.3 x 1: A5 -1.25,-0.34; A6 -0.25,-0.34; A7 0.25,-0.34; A8 1.25,-0.34; B5 1.75,-0.34; B6 0.75,-0.34; B7 -0.75,-0.34; B8 -1.75,-0.34 | smd 0.6 x 1: GND -3.225,-0.34; GND2 3.225,-0.34; VBUS1 -2.45,-0.34; VBUS2 2.45,-0.34 | drill 0.4 pad 0.6 long: SHLD1 -4.318,-0.915; SHLD2 4.318,-0.915; SHLD3 -4.318,-5.095; SHLD4 4.318,-5.095 | hole 0.65: -2.89,-1.445; 2.89,-1.445
JST04_1MM_RA = smd 0.6 x 1.35: 1 -1.5,0; 2 -0.5,0; 3 0.5,0; 4 1.5,0 | smd 1.2 x 2: NC1 2.8,-3.675; NC2 -2.8,-3.675
1X11_NO_SILK = drill 1.016 pad 1.88: 1 0,0; 2 2.54,0; 3 5.08,0; 4 7.62,0; 5 10.16,0; 6 12.7,0; 7 15.24,0; 8 17.78,0; 9 20.32,0; 10 22.86,0; 11 25.4,0
1X09_NO_SILK = drill 1.016 pad 1.88: 1 0,0; 2 2.54,0; 3 5.08,0; 4 7.62,0; 5 10.16,0; 6 12.7,0; 7 15.24,0; 8 17.78,0; 9 20.32,0
1X06_NO_SILK = drill 1.016 pad 1.88: 1 0,0; 2 2.54,0; 3 5.08,0; 4 7.62,0; 5 10.16,0; 6 12.7,0
0603 = smd 1.1 x 1: 1 -0.85,0; 2 0.85,0
1206_RA = smd 0.8 x 0.55: P1 -1.2,-0.62; P4 1.2,-0.62; P5 1.2,0.68; P8 -1.2,0.68 | smd 0.5 x 0.55: P2 -0.4,-0.62; P3 0.4,-0.62; P6 0.4,0.68; P7 -0.4,0.68
SMT-JUMPER_2_NO_SILK = smd 0.635 x 1.27: 1 -0.406,0; 2 0.406,0
PAD.03X.05 = smd 1.27 x 1.27: 1 0,0
SO08 = smd 0.6 x 1.2: 1 -1.905,-2.8; 2 -0.635,-2.8; 3 0.635,-2.8; 4 1.905,-2.8; 5 1.905,2.8; 6 0.635,2.8; 7 -0.635,2.8; 8 -1.905,2.8
SIP6_MICROPAK2 = smd 0.19 x 0.5: P1 -0.36,-0.4; P2 -0.01,-0.4; P3 0.34,-0.4; P4 0.34,0.43; P5 -0.01,0.43; P6 -0.36,0.43
SOT23-5 = smd 0.55 x 1.2: 1 -0.95,-1.3; 2 0,-1.3; 3 0.95,-1.3; 4 0.95,1.3; 5 -0.95,1.3
UBLOX_ZED_F9R = smd 1.1 x 1.1: G1 -7.312,-5.37; G2 -5.212,-5.37; G3 -3.112,-5.37; G4 -1.012,-5.37; G5 1.088,-5.37; G6 3.188,-5.37; G7 5.288,-5.37; G8 7.388,-5.37; G9 7.388,-3.27; G10 5.288,-3.27; G11 3.188,-3.27; G12 1.088,-3.27; G13 -1.012,-3.27; G14 -3.112,-3.27; G15 -5.212,-3.27; G16 -7.312,-3.27; G17 -7.312,-1.17; G18 -5.212,-1.17; G19 -3.112,-1.17; G20 -1.012,-1.17; G21 1.088,-1.17; G22 3.188,-1.17; G23 5.288,-1.17; G24 7.388,-1.17; G25 7.388,0.93; G26 5.288,0.93; G27 3.188,0.93; G28 1.088,0.93; G29 -1.012,0.93; G30 -3.112,0.93; G31 -5.212,0.93; G32 -7.312,0.93; G33 -7.312,3.03; G34 -5.212,3.03; G35 -3.112,3.03; G36 -1.012,3.03; G37 1.088,3.03; G38 3.188,3.03; G39 5.288,3.03; G40 7.388,3.03; G41 7.388,5.13; G42 5.288,5.13; G43 3.188,5.13; G44 1.088,5.13; G45 -1.012,5.13; G46 -3.112,5.13; G47 -5.212,5.13; G48 -7.312,5.13 | smd 0.8 x 1.5: P1 -7.112,-7.62; P2 -6.012,-7.62; P3 -4.912,-7.62; P4 -3.812,-7.62; P5 -2.712,-7.62; P6 -1.612,-7.62; P7 -0.512,-7.62; P8 0.588,-7.62; P9 1.688,-7.62; P10 2.788,-7.62; P11 3.888,-7.62; P12 4.988,-7.62; P13 6.088,-7.62; P14 7.188,-7.62; P28 7.188,7.33; P29 6.088,7.33; P30 4.988,7.33; P31 3.888,7.33; P32 2.788,7.33; P33 1.688,7.33; P34 0.588,7.33; P35 -0.512,7.33; P36 -1.612,7.33; P37 -2.712,7.33; P38 -3.812,7.33; P39 -4.912,7.33; P40 -6.012,7.33; P41 -7.112,7.33 | smd 1.5 x 0.8: P15 9.988,-6.77; P16 9.988,-5.67; P17 9.988,-4.57; P18 9.988,-3.47; P19 9.988,-2.37; P20 9.988,-1.27; P21 9.988,-0.17; P22 9.988,0.93; P23 9.988,2.03; P24 9.988,3.13; P25 9.988,4.23; P26 9.988,5.33; P27 9.988,6.43; P42 -9.912,6.43; P43 -9.912,5.33; P44 -9.912,4.23; P45 -9.912,3.13; P46 -9.912,2.03; P47 -9.912,0.93; P48 -9.912,-0.17; P49 -9.912,-1.27; P50 -9.912,-2.37; P51 -9.912,-3.47; P52 -9.912,-4.57; P53 -9.912,-5.67; P54 -9.912,-6.77

### Placement (x,y rotation side)
$1_25_$_2020-03-30_22-52-05  40.64,48.26 0 top
BT2  28.83,43.05 270 top
C1  27.56,5.71 0 top
C2  25.02,34.8 0 top
C3  35.98,18.01 180 top
C4  35.58,6.89 180 top
C5  19.53,35.53 0 top
C6  26.29,13.46 90 top
C7  22.38,10.8 270 top
C8  21.08,13.84 0 top
C9  23.11,40.89 0 top
C10  26.16,37.49 90 top
C11  21.84,34.8 0 top
C12  19.56,34.54 0 top
D1  35.98,15.54 0 top
D2  36.11,9.31 0 top
D3  12.45,41.96 270 top
D4  24.13,2.54 0 top
D5  28.45,2.54 0 top
D6  35.94,2.54 0 top
D7  32.13,2.54 0 top
D8  27.99,38.1 270 top
D9  17.53,11.43 180 top
E1  14.02,2.24 180 top
FB1  17.53,15.62 0 top
FD1  5.08,5.08 0 top
FD2  5.08,5.08 0 bottom
FD3  36.83,46.99 0 top
FD4  36.83,46.99 0 bottom
FRAME1  -2.03,-26.42 0 top  (outside the outline)
GEO  32.13,1.6 0 bottom
H1  STAND-OFFTIGHT  [STAND-OFF-TIGHT]  2.54,2.51 0 top
H2  2.54,48.26 0 top
H4  STAND-OFFTIGHT  [STAND-OFF-TIGHT]  40.64,2.51 0 top
I2C  9.65,33.27 90 bottom
J2  12.7,44.48 180 top
J3  5.08,41.91 270 top
J4  38.1,41.91 90 top
J5  41.91,36.83 270 top
J6  1.27,16.51 90 top
J7  34.29,49.53 180 top
LOGO1  2.58,6.24 0 bottom
LOGO2  36.07,41.91 270 top
LOGO3  21.59,36.83 0 bottom
LOGO4  QWIIC_LOGO_4MM  [QWIIC_4MM]  6.99,41.91 90 top
PPS  28.45,1.6 0 bottom
PWR  24.64,1.6 0 bottom
R1  35.98,13.23 180 top
R2  35.98,5.42 180 top
R3  19.71,36.73 180 top
R4  30.48,13.68 90 top
R5  35.98,19.54 180 top
R6  35.98,11.73 180 top
R7  24.79,7.78 270 top
R8  8.76,24.26 270 top
R9  8.76,28.7 270 top
R10  35.43,29.46 270 top
R11  35.43,22.23 270 top
R12  9.37,18.41 180 top
R13  21.34,15.62 0 top
R14  6.35,47.75 270 top
R15  19.05,47.75 270 top
R16  9.75,34.13 0 top
R17  24.13,1.14 0 top
R18  28.45,1.14 0 top
R19  35.94,1.14 0 top
R20  32.13,1.14 0 top
R21  13.97,38.1 270 top
R22  12.45,38.1 270 top
R23  9.75,32.66 0 top
R24  30.12,38.1 270 top
RTK  36.07,1.6 0 bottom
SHIELD  17.14,48.01 0 bottom
SPI  9.47,27.13 90 bottom
TP1  29.21,43.18 0 bottom
U1  29.94,9.26 90 top
U3  24.2,10.94 0 top
U4  28.19,13.46 90 top
U5  23.62,38.23 180 top
U6  22.86,25.4 0 top
U$1  [ZED#F9R21]  8,4.45 270 top
U$2  [L1#L26]  20.45,2.79 270 top
U$3  [ANTENNA6]  19.3,3.81 270 top
U$4  [X17]  7.62,11.94 0 top
U$5  [#GND#16]  3.94,36.83 0 top
U$6  [#GND#16]  39.24,36.7 0 top
U$7  [#GND#16]  21.59,46.86 90 top
U$8  [#GND#16]  3.94,36.83 0 bottom
U$9  [#GND#16]  39.24,36.7 0 bottom
U$10  [#D##241]  40.01,19.05 0 top
U$11  [#D##240]  39.88,16.51 0 top
U$12  [#W##244]  39.62,11.43 0 top
U$13  [#W##245]  39.75,13.84 0 top
U$14  [#3V3#17]  3.94,34.29 0 top
U$15  [#3V3#17]  39.37,31.75 0 top
U$16  [#3V3#17]  39.37,31.75 0 bottom
U$17  [#3V3#17]  3.94,34.29 0 bottom
U$18  [#5V#17]  39.75,34.29 0 top
U$19  [DEAD#RECKONING#GPS#BOARD#SILK#FINAL#JPG]  22.82,19.26 0 bottom
U$20  [DEAD#RECKONING#GPS#BOARD#SILK#FINAL#JPG]  3.36,10.36 270 top
U$21  [#5V#17]  39.75,34.29 0 bottom
U$22  [#SDA#235]  3.94,31.62 0 top
U$23  [BLK18]  19.56,49.53 0 top
U$24  [##CS##25]  39.75,29.21 0 top
U$25  [#COPI#230]  38.99,24.13 0 top
U$26  [GRN19]  36.58,49.53 0 top
U$27  [#SDA#236]  3.94,31.62 0 bottom
U$28  [#SCL#238]  3.81,29.21 0 top
U$29  [#TXR#248]  3.94,26.54 0 top
U$30  [##RST##28]  3.81,24 0 top
U$31  [##SFBT##26]  4.32,21.46 0 top
U$32  [X17]  7.49,11.94 0 bottom
U$33  [#INT#1]  3.68,19.05 0 top
U$34  [#INT#0]  3.68,19.05 0 bottom
U$35  [#PPS#3]  3.81,16.51 0 top
U$36  [#CIPO#232]  39.12,26.67 0 top
U$37  [#SCLK#233]  38.86,21.59 0 top
U$38  [RXI229]  28.07,47.37 90 top
U$39  [PWR6]  24.64,3.94 0 top
U$40  [RTK12]  36.07,3.94 0 top
U$41  [GEO10]  32.26,3.94 0 top
U$42  [PPS8]  28.57,3.94 0 top
U$43  [Z19]  9.91,13.46 0 top
U$44  [Z19]  9.78,13.46 0 bottom
U$45  [Y18]  11.56,15.62 0 top
U$46  [#SCL#SCLK#2244]  6.1,29.21 0 bottom
U$47  [#GEO#12]  32.26,3.05 0 bottom
U$48  [#RTK#14]  36.07,3.17 0 bottom
U$49  [Y18]  11.43,15.62 0 bottom
U$50  [TXO2234]  31.75,46.23 90 top
U$51  [#PPS#10]  28.45,3.17 0 bottom
U$52  [##CS##26]  39.75,29.21 0 bottom
U$53  [#SPI#4]  11.05,27.18 90 bottom
U$54  [#I2C#5]  11.3,33.4 90 bottom
U$55  [#RXI#CIPO#32]  37.47,26.67 0 bottom
U$56  [#TXO#COPI#33]  36.83,24.13 0 bottom
U$57  [#SCL#SCLK#2243]  37.08,21.59 0 bottom
U$58  [#D##2249]  40.01,19.05 0 bottom
U$59  [#D##2248]  39.88,16.51 0 bottom
U$60  [#W##2253]  39.75,13.84 0 bottom
U$61  [#W##2252]  39.62,11.43 0 bottom
U$62  [#TXR#2255]  3.94,26.54 0 bottom
U$63  [##RST##27]  3.81,23.88 0 bottom
U$64  [##SFBT##29]  4.32,21.46 0 bottom
U$65  [#PPS#2]  3.81,16.51 0 bottom
U$66  [#PWR#8]  24.64,3.17 0 bottom
U$67  [#GND#16]  21.59,46.86 90 bottom
U$68  [#RXI2#34]  29.21,46.74 90 bottom
U$69  [#TXO2#235]  31.75,46.23 90 bottom
U$70  [GRN19]  36.58,49.53 0 bottom
U$71  [BLK18]  19.43,49.53 0 bottom
U$72  [GPS_DEAD_RECKONING24]  22.35,30.73 0 bottom
U$73  [ZED#F9R25]  22.35,29.08 0 bottom
U$74  [#SHLD#2258]  13.72,48.01 0 bottom

### Tracks (layer width: path | path; a pad name or v marks a point on that pad's centre or on a via)
3.3V  (via drill 0.3, 0.35)
  Top 0.152: U3.P6 23.84,11.43 | 23.84,11.86 23.84,11.43 | 23.5,11.43 23.84,11.43
  Top 0.254: R4.2 29.59,14.53 v29.26,14.86 | R7.2 24.79,5.76 | U1.8 27.04,7.25 27.04,5.73 C1.1 | v31.75,35.56 31.75,34.29 v32.77,33.27 | v25.53,12.95 25.54,12.96 C6.1 27.19,12.96 27.33,13.1 U4.P6 | D4.A 23.25,5.22 v23.75,5.71 23.79,5.76 24.79,5.76 | 24.79,5.76 27.02,5.76 C1.1 | D6.A 34.16,3.44 v34.16,3.81 | v34.16,5.08 27.69,5.08 C1.1 | C7.1 22.5,11.43 23.5,11.43 23.78,11.43 U3.P6 23.84,11.86 23.84,12.31 v23.7,12.45 | U6.P38 19.05,34.53 C12.1 19.06,35.51 19.05,35.52 | C5.1 19.03,36.63 R3.2
  Top 0.381: J4.2 v39.24,41.4 | v6.48,42.42 J3.2 | J5.3 41.02,31.75 40.39,32.38 40.39,34.54 v37.78,37.15 | 26.16,36.93 U5.5 24.52,36.87 v24.52,35.56 C2.1 24.52,34.04 | 26.16,36.93 27.97,36.93 D8.A | C10.1 26.16,36.93 | 19.05,35.52 C5.1 19.01,35.56 v18.16,35.56 | U6.P34 23.45,33.73 23.75,34.04 24.52,34.04 | U6.P33 24.52,32.76 24.52,34.04
  Bottom 0.254: I2C.2 11.68,33.27 12.32,33.91 12.32,35.56 | v23.75,5.71 23.75,12.39 v23.7,12.45 24.21,12.95 v25.53,12.95 27.36,12.95 v29.26,14.86 29.26,15.65 30.25,16.64 31.37,16.64 33.59,18.86 33.59,32.45 v32.77,33.27 | v34.16,5.08 v34.16,3.81
  Bottom 0.381: v39.24,41.4 39.24,38.61 v37.78,37.15 36.2,35.56 v31.75,35.56 v24.52,35.56 v18.16,35.56 12.32,35.56 8.83,35.56 7.08,37.31 | v6.48,42.42 6.6,42.42 7.05,41.97 7.05,37.34 7.08,37.31 | J6.8 4.06,34.29 7.08,37.31
!RESET
  Top 0.254: R8.P2 1.8,24.66 J6.4
!SAFEBOOT
  Top 0.254: R8.P3 3.54,23.86 J6.3
D_SEL  (via drill 0.3)
  Top 0.254: v11.68,26.29 11.72,26.33 U6.P47
  Bottom 0.254: v11.68,26.29 11.56,26.16 11.05,26.16 10.49,26.72 SPI.1
DIR+
  Top 0.254: R1.1 37.87,13.23 38.35,13.72 38.35,16 38.86,16.51 J5.9
DIR_IN
  Top 0.254: R5.2 35.13,19.51 34.16,18.54 34.16,16.76 33.75,16.35 33.75,12.67 32.73,11.65 32.73,11.17 U1.4
DIR_INV
  Top 0.152: U4.P2 28.6,13.46 29.21,13.46
  Top 0.254: U1.6 27.15,9.9 28.95,9.9 30.48,11.43 R4.1 29.85,13.46 29.21,13.46 29.2,13.45 U4.P2
DIR_OUT  (via drill 0.3)
  Top 0.152: U4.P4
  Top 0.254: v32.91,15.67 28.24,15.67 27.76,15.19 U4.P4 | R10.P6 36.13,29.08 37.08,29.08 37.47,28.7 v37.47,25.53
  Bottom 0.254: v32.91,15.67 33.37,16.13 35.18,16.13 37.47,18.41 v37.47,25.53
DMINUS
  Top 0.254: R21.2 13.97,35.89 14.37,35.49 16.22,35.49 17.6,34.11 17.95,33.76 U6.P39
DPLUS
  Top 0.254: R22.2 12.45,36.45 13.84,35.05 16,35.05 16.89,34.16 16.89,32.77 U6.P40
GEOF_STAT  (via drill 0.3)
  Top 0.254: D7.A 31.25,3.19 32.51,4.45 37.72,4.45 39.12,5.84 v39.12,9.65 | R11.P7 37.45,22.62 39.12,20.95 v39.12,17.14
  Bottom 0.254: v39.12,9.65 v39.12,17.14
GND  (via drill 0.3)
  Top 0.254: D3.2 12.45,43.05 v12.57,43.18 | C4.2 34.99,8.15 D2.1 | C3.2 35.05,17.66 v35.05,15.54 | U6.P37 20.02,32.86 20.02,34.51 C12.2 20.03,34.57 C5.2 20.03,35.92 20.29,36.17 R3.1
  Top 0.381: U5.2 23.62,40.89 C9.2
  other vias: 14.48,31.5 16.71,31.2 18.79,31.2 20.9,31.2 23.01,31.2 25.12,31.2 27.2,31.2 29.31,31.18 31.49,31.23 14.5,29.42 16.71,29.42 18.79,29.42 20.9,29.42 23.01,29.42 25.12,29.42 27.2,29.42 29.31,29.4 31.49,29.45 14.5,27.24 16.71,27.24 18.79,27.24 20.9,27.24 23.01,27.24 25.12,27.24 27.2,27.24 29.31,27.21 31.49,27.26 14.48,25.15 16.71,25.16 18.79,25.16 20.9,25.16 25.12,25.16 27.2,25.16 29.31,25.13 31.49,25.18 14.5,23.02 16.71,23.02 18.79,23.02 20.9,23.02 23.01,23.02 25.12,23.02 27.2,23.02 29.31,23 31.49,23.05 14.48,20.99 16.69,20.99 18.77,20.99 20.88,20.99 22.99,20.99 25.09,20.99 27.18,20.99 29.28,20.97 31.47,21.02 14.48,19.05 16.58,19.18 18.79,19.06 20.9,19.06 23.01,19.06 25.12,19.06 27.2,19.06 29.31,19.04 30.23,19.05 12.7,16.51 6.35,16.51 6.35,6.35 6.35,3.81 6.35,1.27 10.16,1.27 3.81,16.51 3.81,6.35 5.08,30.48 5.08,39.24 10.16,39.5 10.16,41.91 6.86,43.43 8.92,41.15 40.64,27.94 32.64,34.8 30.48,34.29 27.94,34.29 14.48,33.36 14.48,32.47 15.52,31.5 30.99,17.31 30.99,18.2 30.99,19.05 20.32,43.18 22.86,43.18 25.27,42.55 25.4,45.72 22.86,45.72 20.32,45.72 17.78,43.18 22.86,48.26 19.05,49.53 20.32,48.26 27.94,45.72 30.48,45.72 30.48,43.18 32.77,43.18 32.77,45.72 35.56,45.72 35.56,48.26 36.83,49.53 38.1,45.72 41.91,43.18 41.91,40.64 15.24,13.97 15.24,15.24 19.68,11.43 18.41,9.78 20.07,39.75 17.65,39.75 15.37,39.75 14.48,18.07 14.48,17.16 15.59,19.05 10.16,3.81 13.34,34.29 1.27,43.18 1.27,40.64 6.35,49.53 32.77,40.01 28.19,40.13 25.53,40.13 3.68,43.43 6.35,45.72 5.97,38.1 38.1,39.37 35.56,43.56 10.16,16.51 29.34,5.71 11.43,34.92 35.56,34.29 15.24,16.38 18.16,14.22 17.6,19.05 22.83,25.16 37.34,32.89 5.08,33.02 4.57,35.94 26.16,15.24 25.53,11.13 29.21,7.62 28.96,11.18 29.36,14.02 31.75,14.86 31.72,12.7 18.03,3.81 20.32,6.35 20.32,3.81 20.32,8.89 6.35,13.97 6.35,11.43 6.35,8.89 3.81,11.43 3.81,13.97 3.81,8.89 25.4,4.45 27.94,4.45 30.48,4.45 31.75,5.71 33.78,5.71 30.86,9.4 23.88,13.97 22.23,8.89 19.3,13.84 23.88,15.88 35.13,9.3 36.98,9.27 36.91,15.57 22.23,6.35 22.52,4.54 17.91,1.27 20.32,1.27 35.56,26.54 35.56,24.64 31.88,33.02 38.18,17.6 38.18,19.51 6.35,20.32 6.35,21.59 8.89,21.59 8.89,20.32 11.43,20.32 5.08,27.94 2.54,27.94 7.37,26.67 15.24,12.47 15.24,10.97 15.24,9.47 14.24,8.47 13.24,7.47 12.74,5.97 17.91,8.28 16.91,6.78 15.41,5.78 10.16,13.97 8.89,11.43 8.89,8.89 10.16,6.35 12.7,11.43 16.51,5.08 11.43,5.08 18.41,12.95 12.7,13.97 3.81,19.81 23.37,34.8 26.16,36.2 16.76,36.2 37.47,29.59 14.1,43.05 36.45,38.23 40.64,17.91 40.39,9.78 39.62,44.2 1.27,7.47 34.7,36.2 20.7,34.04
  pour Top (isolate 0.178, rank 2): 0,0 43.18,0 43.18,50.8 0,50.8
  pour Bottom (isolate 0.178, rank 2): 0,0 43.18,0 43.18,50.8 0,50.8
INT
  Top 0.254: R8.P4 5.28,23.06 J6.2
N$1  (via drill 0.3)
  Top 0.254: v11.18,32.64 11.15,32.66 R23.2
  Bottom 0.254: v11.18,32.64 11.18,32.38 11.02,32.23 I2C.1
N$2
  Top 0.254: D8.C 27.99,38.56 28.29,38.26 28.8,38.26 28.96,38.1 28.96,37.47 29.17,37.25 R24.2
N$3  (via drill 0.3)
  Top 0.254: v11.18,34.04 11.08,34.13 R16.2
  Bottom 0.254: v11.18,34.04 10.9,34.31 I2C.3
N$4
  Top 0.254: D4.C 25.01,1.44 R17.2
N$5
  Top 0.508: FB1.2 R13.1 20.49,13.86 C8.1
N$6
  Top 0.254: J2.A6 12.95,45.72 12.7,45.97 12.19,45.97 11.95,45.73 J2.B6 11.94,44.8 11.94,42.4 D3.3
N$7
  Top 0.254: 13.45,43.81 J2.B7 | J2.A7 12.45,44.06 12.7,43.81 13.45,43.81 | D3.1 12.95,42.66 13.45,43.17 13.45,43.81
N$8  (via drill 0.3)
  Top 0.254: R17.1 22.35,1.14 v22.23,1.27
  Bottom 0.254: v22.23,1.27 22.55,1.6 PWR.2
N$9
  Top 0.254: D3.6 12.95,41.16 13.97,40.13 R21.1
N$10
  Top 0.254: D3.4 11.95,40.24 12.45,39.74 R22.1
N$11
  Top 0.254: R8.P7 10.65,24.66 11.18,24.13 U6.P49
N$12
  Top 0.254: R8.P5 10.47,23.06 11.6,21.93 U6.P51
N$14
  Top 0.254: J2.B5 10.95,46.45 10.23,47.17 R14.2
N$15
  Top 0.254: J2.A5 13.95,46.46 14.53,47.05 18.92,47.05 R15.2
N$16
  Top 0.254: R9.P6 10.1,28.3 11.43,29.63 U6.P44
N$17
  Top 0.254: R9.P5 9.98,27.5 11.05,28.57 12.9,28.57 U6.P45
N$18
  Top 0.254: R8.P8 9.84,25.46 11.81,27.43 U6.P46
N$19
  Top 0.254: R9.P8 10.15,29.9 12.08,31.83 U6.P42
N$20
  Top 0.254: R9.P7 10.16,29.1 11.79,30.73 U6.P43
N$21
  Top 0.254: R10.P1 34.81,31.23 34.21,31.83 U6.P27
N$22  (via drill 0.3)
  Top 0.254: R19.1 v34.04,1.14
  Bottom 0.254: v34.04,1.14 34.49,1.6 RTK.2
N$23  (via drill 0.3)
  Top 0.254: R18.1 26.29,1.14 v26.16,1.27
  Bottom 0.254: v26.16,1.27 26.42,1.52 27.85,1.52 PPS.2
N$24
  Top 0.254: R18.2 29.3,2.51 D5.C
N$25
  Top 0.254: D6.C 36.82,1.17 R19.2
N$26
  Top 0.254: R10.P2 34.27,29.86 34.16,29.97 34.16,30.48 33.91,30.73 U6.P26
N$27
  Top 0.254: R11.P2 34.14,22.62 33.74,23.03 U6.P19
N$28
  Top 0.254: R11.P1 34.81,23.93 34.62,24.13 U6.P20
N$29
  Top 0.254: R12.1 10.29,18.41 11.6,19.73 U6.P53
N$30
  Top 0.254: R8.P6 9.46,23.88 10.54,23.88 11.39,23.03 U6.P50
N$31
  Top 0.254: R10.P4 34.81,27.19 33.95,26.33 U6.P22
N$32
  Top 0.254: R10.P3 34.4,29.06 34.16,28.83 34.16,27.69 33.91,27.43 U6.P23
N$33  (via drill 0.3)
  Top 0.254: R20.1 31.11,1.14 v30.35,1.91
  Bottom 0.254: v30.35,1.91 30.66,1.6 GEO.2
N$34
  Top 0.254: D7.C 33.01,1.17 R20.2
N$35
  Top 0.254: R2.2 35.23,5.42 36.16,6.34 C4.1 36.11,6.94 D2.3 36.11,11.01 R6.1
N$37
  Top 0.254: R1.2 35.98,14.08 D1.3 36.56,17.22 C3.1 36.56,19.27 R5.1
PPS  (via drill 0.3)
  Top 0.254: J6.1 3.17,18.41 v7.49,18.41 R12.2 | D5.A 27,3.11 27,4 26,5 v24.5,5
  Bottom 0.254: v24.5,5 23.5,5 23,5.5 23,12.7 23,18 21.25,19.75 11.6,19.75 10.26,18.41 v7.49,18.41
RF_IN
  Top 1: E1.SIG 14.02,5.69 arc-74 15.34,7.44 arc81 16.83,9.7
  pour Top (no thermals): 16.38,9.53 17.27,9.53 17.27,18.36 16.38,18.36
RTK_STAT  (via drill 0.3)
  Top 0.254: v39.75,10.54 39.75,5.71 38.1,4.06 v38.1,1.27 | R11.P8 37.53,23.43 39.73,21.23 39.73,17.55 v39.75,17.53
  Bottom 0.254: v39.75,10.54 v39.75,17.53 | v38.1,1.27 37.77,1.6 RTK.1
RXI2
  Top 0.254: R10.P7 36.58,29.86 36.83,30.11 36.83,31.9 34.16,34.57 34.16,46.1 32.07,48.19 30.56,48.19 J7.3
RXI/CIPO  (via drill 0.3)
  Top 0.254: v36.07,37.47 36.45,37.47 39.5,34.42 39.5,27.56 40.39,26.67 J5.5 | v10.03,37.47 9.91,37.47 7.11,34.67 7.11,29.59 7.6,29.1 R9.P2
  Bottom 0.254: v36.07,37.47 v10.03,37.47
SCL/CLK  (via drill 0.3)
  Top 0.254: v36.7,43.43 38.08,43.43 J4.4 38.12,43.43 v39.24,43.43 | J5.7 40.89,21.59 38.1,24.38 38.1,34.04 37.34,34.8 v37.21,34.8 | J6.6 2.54,29.21 3.81,30.48 3.81,39.62 4.6,40.41 J3.4 6.96,40.41 8.03,39.34 v8.03,38.89 8.03,37.57 5.84,35.38 v5.84,33.78 | v5.84,33.78 5.84,28.7 7.04,27.5 R9.P4 | v5.84,33.78 | R16.1 8.35,34.13 v8.26,34.04
  Bottom 0.254: v36.7,43.43 36.2,42.93 36.2,40.26 34.82,38.89 v8.03,38.89 | v39.24,43.43 39.5,43.43 40.13,42.8 40.13,37.97 37.21,35.05 v37.21,34.8 | v8.26,34.04 8,33.78 v5.84,33.78
SDA/!CS  (via drill 0.3)
  Top 0.254: v36.83,42.29 36.95,42.41 J4.3 38.15,42.46 39.47,42.46 40.13,41.79 40.13,41.02 39.37,40.26 39.37,37.72 40.39,36.7 v40.39,36.58 | J6.7 2.67,31.75 3.3,32.38 3.3,40.64 4.07,41.41 J3.3 7.36,41.41 9.14,39.62 v9.14,38.1 9.14,37.59 6.48,34.92 v6.48,32.77 6.48,29.46 7.64,28.3 R9.P3 | R23.1 8.36,32.66 v8.26,32.77
  Bottom 0.254: v9.14,38.1 35.18,38.1 36.83,39.75 v36.83,42.29 | v40.39,36.58 40.39,30.73 J5.4 | v8.26,32.77 v6.48,32.77
SHIELD  (via drill 0.3)
  other vias: 9.27,46.61 10.16,48.26 15.24,48.26 14.73,46.35
  pour Top (no thermals): 8.13,44.83 17.27,44.83 17.27,50.67 8.13,50.67
  pour Bottom (no thermals): 8.13,44.83 17.27,44.83 17.27,50.67 8.13,50.67
TX_READY
  Top 0.254: J6.5 2.54,25.4 8.09,25.4 R8.P1
TXO2  (via drill 0.3)
  Top 0.254: R10.P8 36.11,31.58 33.4,34.29 33.4,45.92 31.75,47.58 v31.75,47.66
  Bottom 0.254: v31.75,47.66 J7.2
TXO/COPI  (via drill 0.3)
  Top 0.254: v35.56,36.83 36.2,36.83 38.73,34.29 38.73,25.65 40.26,24.13 J5.6 | v10.92,36.83 10.03,36.83 7.62,34.42 7.62,31.24 8.14,30.72 R9.P1
  Bottom 0.254: v35.56,36.83 27.94,36.83 v10.92,36.83
V_BATT  (via drill 0.3)
  Top 0.254: R24.1 30.67,39.5 v31.39,39.5 31.39,40.5 BT2.+ 29.98,41.91 v29.21,41.91 | U6.P36 21.34,32.83 C11.1 21.34,39.49 v21.34,39.5
  Bottom 0.254: v31.39,39.5 v21.34,39.5 | v29.21,41.91 TP1.1
V_RF
  Top 0.508: R13.2 22.31,15.75 22.31,17.75 U6.P7
VIN  (via drill 0.3)
  Top 0.254: J2.VBUS1 15.15,43.98 v14.92,43.75 | J2.VBUS2 10.25,43.65 v10.16,43.56 | D3.5 12.45,40.64 v12.83,40.26
  Top 0.381: U5.1 24.57,38.67 24.38,38.48 22.86,38.48 22.67,38.67 U5.3 22.61,39.59 22.61,40.85 v21.59,40.85 | v21.59,40.85 14.99,40.85 v14.92,40.92 v14.92,43.75 | J5.2 41.78,34.29 35.18,40.89 v34.92,40.89 | C9.1 22.57,40.85 v21.59,40.85
  Bottom 0.254: v14.92,43.75 14.61,44.07 10.67,44.07 v10.16,43.56 | v12.83,40.26 13.08,40.26 13.74,40.92 v14.92,40.92
  Bottom 0.381: v21.59,40.85 34.89,40.85 v34.92,40.89
WT+
  Top 0.254: R2.1 37.8,5.42 38.48,6.1 38.48,11.18 38.73,11.43 J5.11
WT_IN
  Top 0.254: R6.2 34.34,10.94 34.34,8.05 33.64,7.35 U1.1
WT_INV
  Top 0.254: U1.7 27.13,8.63 R7.1 24.7,8.72 24.7,9.46 24.19,9.97 U3.P2
WT_OUT  (via drill 0.3)
  Top 0.152: U3.P4 24.54,11.43 | 24.54,11.89
  Top 0.254: v33.04,16.68 31.9,16.68 31.34,16.13 25.78,16.13 24.54,14.88 24.54,11.89 | v36.83,24.64 36.87,24.68 36.87,28.03 36.58,28.32 36.17,28.32 R10.P5 | 24.54,11.43 24.54,11.89
  Bottom 0.254: v33.04,16.68 33.04,16.76 35.05,16.76 36.83,18.54 v36.83,24.64

### Text on the board
Bottom: v11
tPlace: - | +
Measures: Units In Inches
tDocu: Elias Santistevan